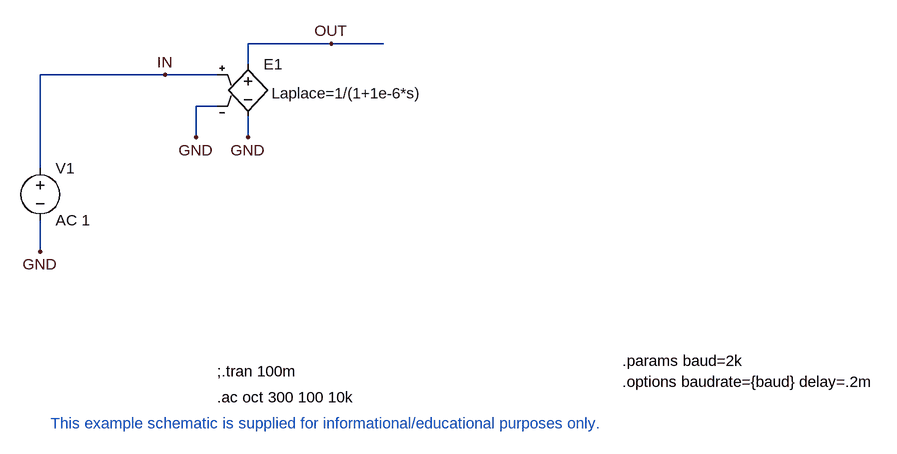
[diagram p0: schematic issue.asc]
issue.asc, the LTspice schematic file:
Version 4
SHEET 1 1672 688
WIRE 336 -288 336 -432
WIRE 336 -160 336 -208
WIRE 656 -368 656 -336
WIRE 608 -384 576 -384
WIRE 576 -384 576 -336
WIRE 656 -448 656 -480
WIRE 656 -480 784 -480
WIRE 608 -432 528 -432
WIRE 528 -432 336 -432
WIRE 784 -480 864 -480
FLAG 336 -160 GND
FLAG 656 -336 GND
FLAG 576 -336 GND
FLAG 528 -432 IN
FLAG 784 -480 OUT
SYMBOL voltage 336 -304 R0
SYMATTR InstName V1
SYMATTR Value AC 1
SYMBOL e 656 -464 R0
WINDOW 38 36 60 Left 0
SYMATTR InstName E1
SYMATTR SpiceModel Laplace=1/(1+1e-6*s)
SYMATTR Value ""
TEXT 608 64 Left 0 !.ac oct 300 100 10k
TEXT 1232 40 Left 0 !.options baudrate={baud} delay=.2m
TEXT 1232 8 Left 0 !.params baud=2k
TEXT 608 24 Left 0 !;.tran 100m
text 352 104 Left 0 ;This example schematic is supplied for informational/educational purposes only.

The netlist it stands for:
* issue.asc
V1 IN GND AC 1
E1 OUT GND IN GND Laplace=1/(1+1e-6*s)
.ac oct 300 100 10k
.options baudrate={baud} delay=.2m
.params baud=2k
;.tran 100m
* This example schematic is supplied for informational/educational purposes only.
.backanno
.end